# EAGLE design irisc (EAGLE 9.2.2)
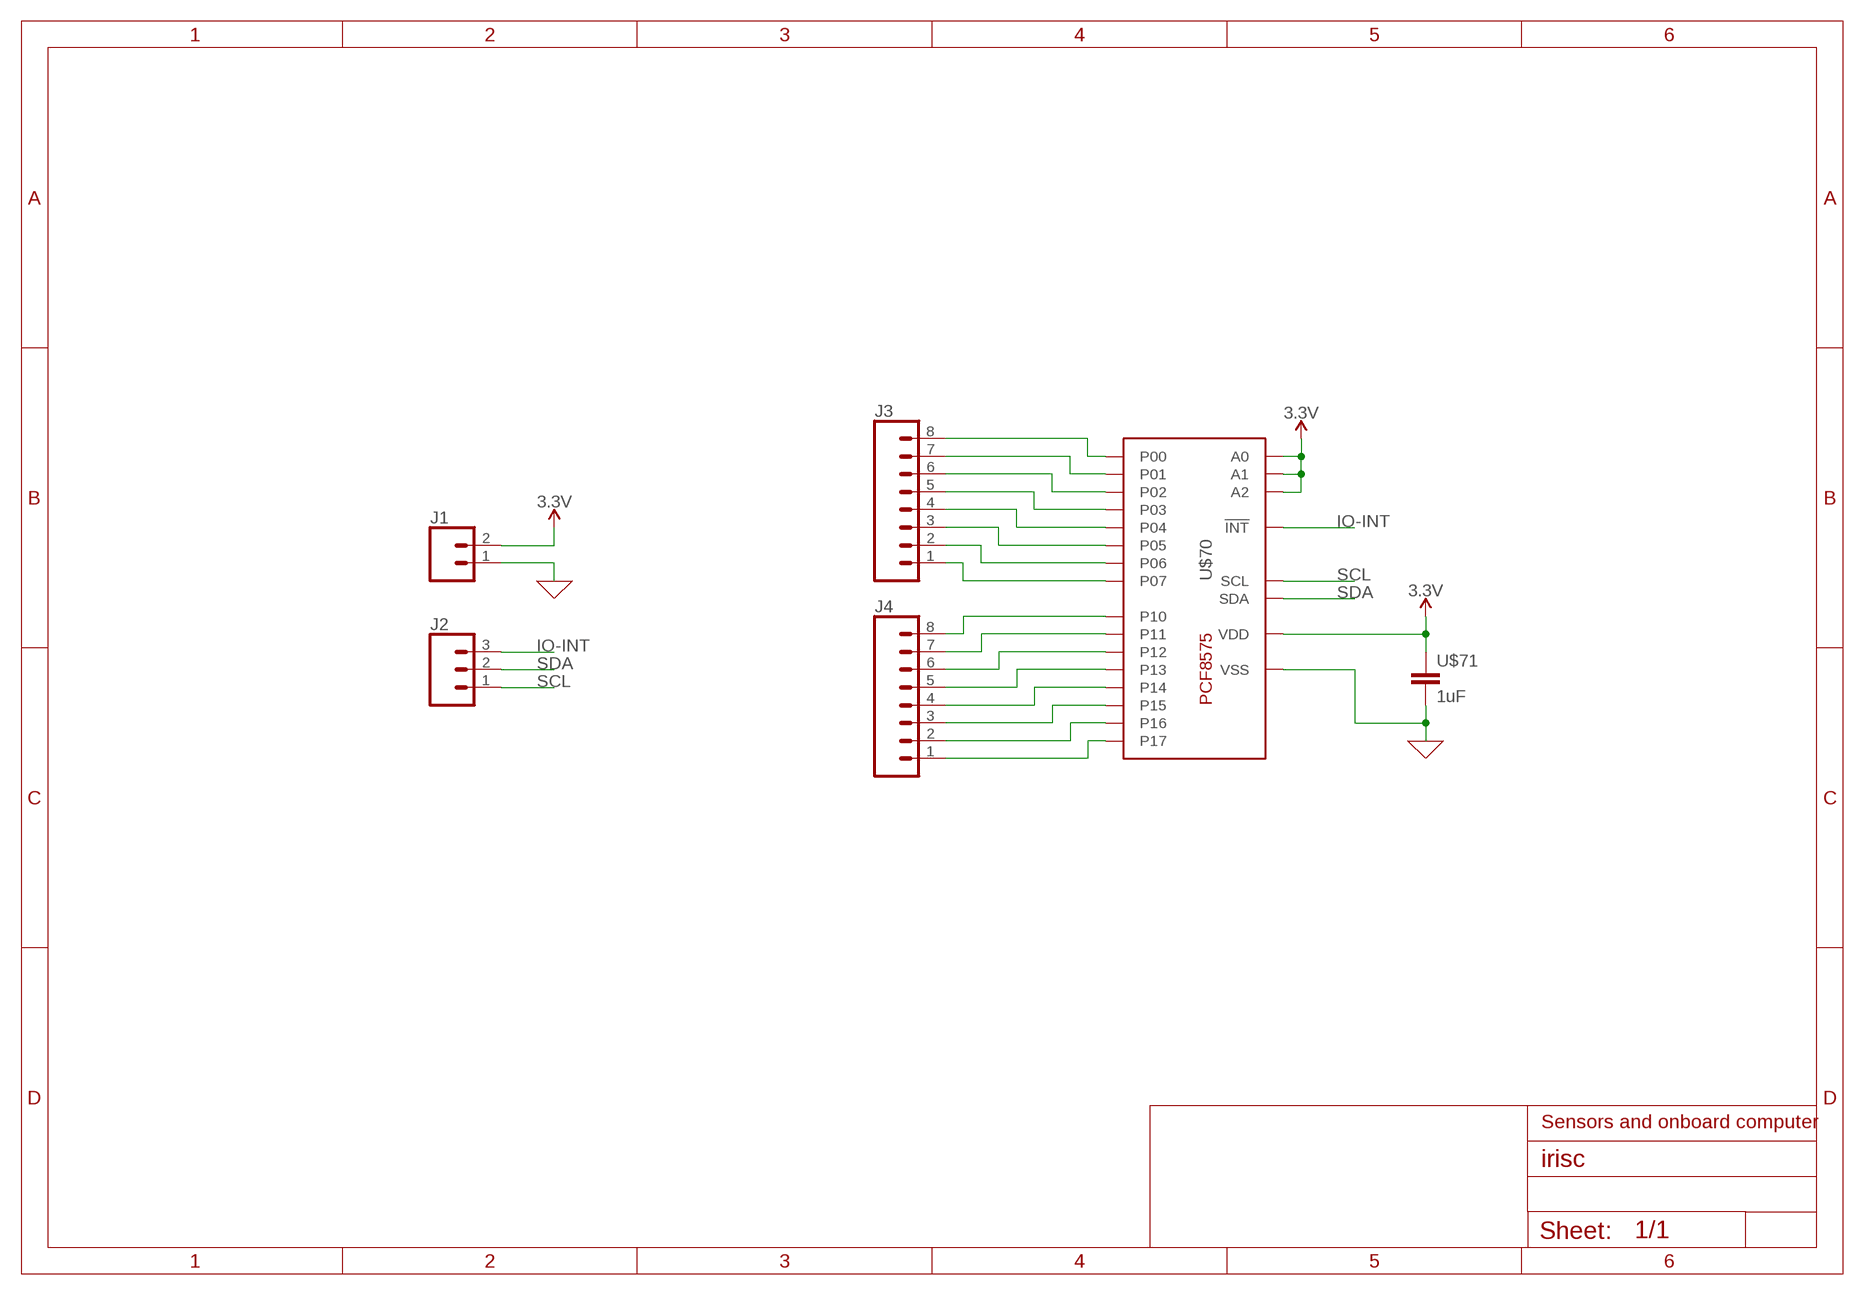
[diagram p0: schematic, sheet 1]

## Parts
J1  CONN_02  [1X02]
J2  CONN_03  [1X03]
J3  CONN_08"  [1X08]
J4  CONN_08"  [1X08]
U$70  PCF8575CSSOP24N  [SOP65P810X120-24]
U$71  1uF  CAPACITOR_0603_N  [RESC0603_N]

## Nets
0: J1.1 U$70.12(VSS) U$71.2 ; supply symbol labelled GND
3.3V: J1.2 U$70.2(A1) U$70.3(A2) U$70.21(A0) U$70.24(VDD) U$71.1
IO-INT: J2.3 U$70.1(!INT)
N$1: J3.8 U$70.4(P00)
N$2: J3.7 U$70.5(P01)
N$3: J3.6 U$70.6(P02)
N$4: J3.5 U$70.7(P03)
N$5: J3.4 U$70.8(P04)
N$6: J3.3 U$70.9(P05)
N$7: J3.2 U$70.10(P06)
N$8: J3.1 U$70.11(P07)
N$9: J4.8 U$70.13(P10)
N$10: J4.7 U$70.14(P11)
N$11: J4.6 U$70.15(P12)
N$12: J4.5 U$70.16(P13)
N$13: J4.4 U$70.17(P14)
N$14: J4.3 U$70.18(P15)
N$15: J4.2 U$70.19(P16)
N$16: J4.1 U$70.20(P17)
SCL: J2.1 U$70.22(SCL)
SDA: J2.2 U$70.23(SDA)

## Notes on the sheet
- Sensors and onboard computer

## Library data of the parts
J1 = SparkFun-Connectors:CONN_02: Multi connection point. Often used as Generic Header-pin footprint for 0.1 inch spaced/style header connections On any of the 0.1 inch spaced packages, you can populate with these: Break Away Headers - Straight <https://www.sparkfun.com/products/116> (PRT-00116) Break Away Male Headers - Right Angle <https://www.sparkfun.com/products/553> (PRT-00553) Female Headers <https://www.sparkfun.com/products/115> (PRT-00115) Break Away Headers - Machine Pin <https://www.sparkfun.com/products/117> (PRT-00117) Break Away Female Headers - Swiss Machine Pin <https://www.sparkfun.com/products/743> (PRT-00743) For SCREWTERMINALS and SPRING TERMINALS visit here: Screw Terimnals on SparkFun.com <https://www.sparkfun.com/search/results?term=Screw+Terminals> (5mm/3.5mm/2.54mm spacing) This device is also useful as a general connection point to wire up your design to another part of your project. Our various solder wires solder well into these plated through hole pads. Hook-Up Wire - Assortment (Stranded, 22 AWG) <https://www.sparkfun.com/products/11375> (PRT-11375) Hook-Up Wire - Assortment (Solid Core, 22 AWG) <https://www.sparkfun.com/products/11367> (PRT-11367) View the entire wire category on our website here <https://www.sparkfun.com/categories/141> Special notes: Molex polarized connector foot print use with: PRT-08233 with associated crimp pins and housings. 2.54_SCREWTERM for use with PRT-10571. 3.5mm Screw Terminal footprints for PRT-08084 5mm Screw Terminal footprints for use with PRT-08432
J2 = SparkFun-Connectors:CONN_03: Multi connection point. Often used as Generic Header-pin footprint for 0.1 inch spaced/style header connections On any of the 0.1 inch spaced packages, you can populate with these: Break Away Headers - Straight <https://www.sparkfun.com/products/116> (PRT-00116) Break Away Male Headers - Right Angle <https://www.sparkfun.com/products/553> (PRT-00553) Female Headers <https://www.sparkfun.com/products/115> (PRT-00115) Break Away Headers - Machine Pin <https://www.sparkfun.com/products/117> (PRT-00117) Break Away Female Headers - Swiss Machine Pin <https://www.sparkfun.com/products/743> (PRT-00743) Stackable Header - 3 Pin (Female, 0.1") <https://www.sparkfun.com/products/13875> (PRT-13875) For SCREWTERMINALS and SPRING TERMINALS visit here: Screw Terimnals on SparkFun.com <https://www.sparkfun.com/search/results?term=Screw+Terminals> (5mm/3.5mm/2.54mm spacing) This device is also useful as a general connection point to wire up your design to another part of your project. Our various solder wires solder well into these plated through hole pads. Hook-Up Wire - Assortment (Stranded, 22 AWG) <https://www.sparkfun.com/products/11375> (PRT-11375) Hook-Up Wire - Assortment (Solid Core, 22 AWG) <https://www.sparkfun.com/products/11367> (PRT-11367) View the entire wire category on our website here <https://www.sparkfun.com/categories/141> Special notes: Molex polarized connector foot print use with SKU : PRT-08232 with associated crimp pins and housings.
J3 J4 = SparkFun-Connectors:CONN_08: Multi connection point. Often used as Generic Header-pin footprint for 0.1 inch spaced/style header connections On any of the 0.1 inch spaced packages, you can populate with these: Break Away Headers - Straight <https://www.sparkfun.com/products/116> (PRT-00116) Break Away Male Headers - Right Angle <https://www.sparkfun.com/products/553> (PRT-00553) Female Headers <https://www.sparkfun.com/products/115> (PRT-00115) Break Away Headers - Machine Pin <https://www.sparkfun.com/products/117> (PRT-00117) Break Away Female Headers - Swiss Machine Pin <https://www.sparkfun.com/products/743> (PRT-00743) Arduino Stackable Header - 8 Pin <https://www.sparkfun.com/products/9279> (PRT-09279) For SCREWTERMINALS and SPRING TERMINALS visit here: Screw Terimnals on SparkFun.com <https://www.sparkfun.com/search/results?term=Screw+Terminals> (5mm/3.5mm/2.54mm spacing) This device is also useful as a general connection point to wire up your design to another part of your project. Our various solder wires solder well into these plated through hole pads. Hook-Up Wire - Assortment (Stranded, 22 AWG) <https://www.sparkfun.com/products/11375> (PRT-11375) Hook-Up Wire - Assortment (Solid Core, 22 AWG) <https://www.sparkfun.com/products/11367> (PRT-11367) View the entire wire category on our website here <https://www.sparkfun.com/categories/141> Special notes: Molex polarized connector foot print use with SKU : PRT-08231 with associated crimp pins and housings. 1MM SMD Version SKU: PRT-10208 NOTES ON THE VARIANTS LOCK and LOCK_LONGPADS... This footprint was designed to help hold the alignment of a through-hole component (i.e. 6-pin header) while soldering it into place. You may notice that each hole has been shifted either up or down by 0.005 of an inch from it's more standard position (which is a perfectly straight line). This slight alteration caused the pins (the squares in the middle) to touch the edges of the holes. Because they are alternating, it causes a "brace" to hold the component in place. 0.005 has proven to be the perfect amount of "off-center" position when using our standard breakaway headers. Although looks a little odd when you look at the bare footprint, once you have a header in there, the alteration is very hard to notice. Also,if you push a header all the way into place, it is covered up entirely on the bottom side.; PROD_ID: CONN-08438
U$70 = pcf8575c:PCF8575C
U$71 = Nordic_nRF:CAPACITOR: Generic chip capacitor

## Board
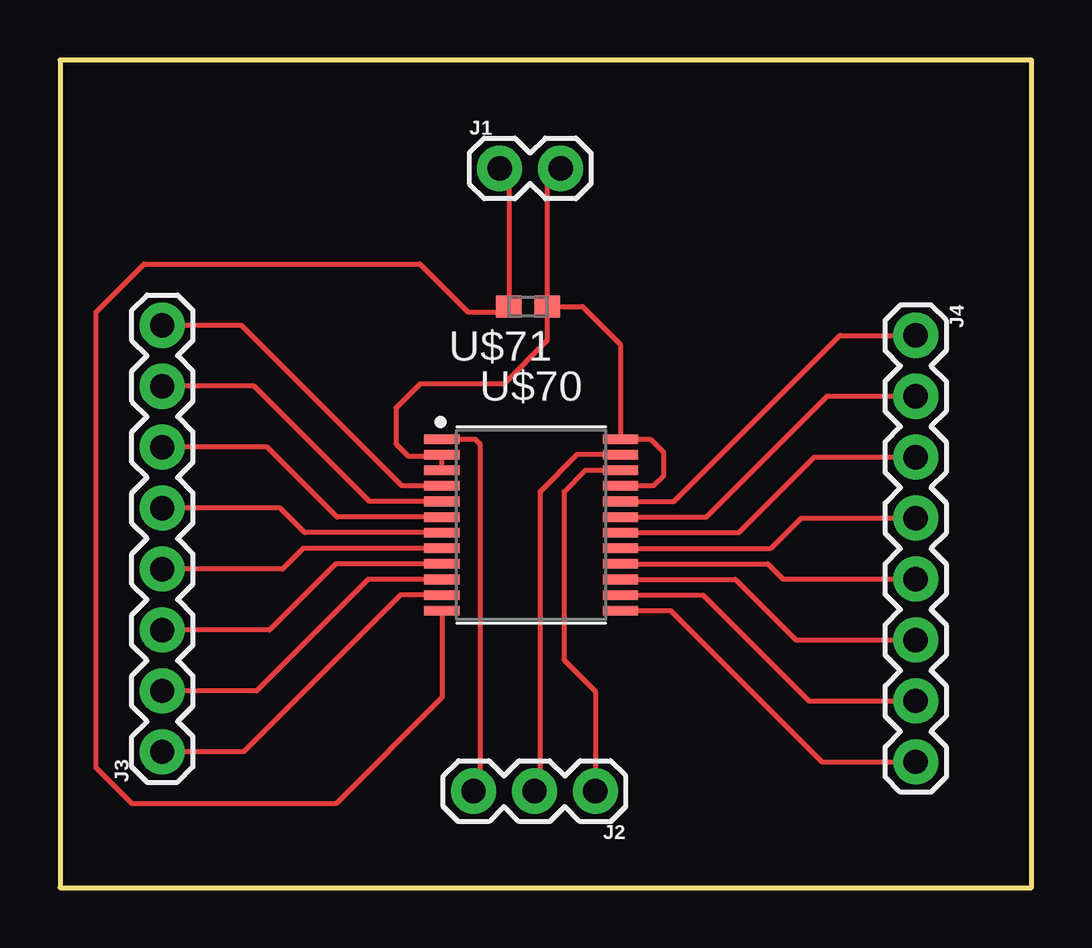
[diagram p1: board, top side]

Size 40.5 x 34.5 mm. Coordinates in mm from the lower left corner, seen from the top.
Outline: 0,0 40.5,0 40.5,34.5 0,34.5 0,0
Copper layers (1*16): Top 0.035mm / dielectric 1.5mm / Bottom 0.035mm
Design rules "default": minimum track width 6mil, minimum drill 0.35mm, track to track 6mil, track to pad 6mil, pad to pad 6mil, via to via 6mil, smd to smd 6mil, copper to edge 40mil, drill to drill 6mil, minimum pad ring 10mil, minimum via ring 8mil, stop-mask expansion 4mil, vias tented up to drill 0mil, thermal gap 10mil

### Footprints (pad centres in the part's own frame; a part is rotated, then mirrored left to right if it is on the bottom)
1X02 = drill 1.016 pad 1.88: 1 0,0; 2 2.54,0
1X03 = drill 1.016 pad 1.88: 1 0,0; 2 2.54,0; 3 5.08,0
1X08 = drill 1.016 pad 1.88: 1 0,0; 2 2.54,0; 3 5.08,0; 4 7.62,0; 5 10.16,0; 6 12.7,0; 7 15.24,0; 8 17.78,0
SOP65P810X120-24 = smd 1.469 x 0.402: 1 -3.721,3.575; 2 -3.721,2.925; 3 -3.721,2.275; 4 -3.721,1.625; 5 -3.721,0.975; 6 -3.721,0.325; 7 -3.721,-0.325; 8 -3.721,-0.975; 9 -3.721,-1.625; 10 -3.721,-2.275; 11 -3.721,-2.925; 12 -3.721,-3.575; 13 3.721,-3.575; 14 3.721,-2.925; 15 3.721,-2.275; 16 3.721,-1.625; 17 3.721,-0.975; 18 3.721,-0.325; 19 3.721,0.325; 20 3.721,0.975; 21 3.721,1.625; 22 3.721,2.275; 23 3.721,2.925; 24 3.721,3.575
RESC0603_N = smd 1.05 x 0.9: 1 -0.8,0; 2 0.8,0

### Placement (x,y rotation side)
J1  18.33,29.98 0 top
J2  22.32,4.02 180 top
J3  4.26,5.66 90 top
J4  35.67,23.02 270 top
U$70  19.64,15.12 0 top
U$71  19.51,24.22 180 top

### Tracks (layer width: path | path; a pad name or v marks a point on that pad's centre or on a via)
0
  Top 0.2: J1.1 18.71,29.6 U$71.2 18.49,24 17,24 15,26 3.5,26 1.5,24 1.5,5 3,3.5 11.5,3.5 15.92,7.92 U$70.12
3.3V
  Top 0.2: J1.2 20.31,29.42 U$71.1 | U$71.1 21.78,24.22 23.36,22.64 U$70.24 24.61,18.7 25.15,18.16 25.15,17.14 24.75,16.75 U$70.21 | U$70.3 15.92,18 | 15.92,18 U$70.2 | U$71.1 20.31,22.81 18.5,21 15,21 14,20 14,18.5 14.5,18 15.92,18
IO-INT
  Top 0.2: U$70.1 17.3,18.7 17.5,18.5 17.5,4.28 J2.3
N$1
  Top 0.2: U$70.4 14.26,16.75 7.56,23.44 J3.8
N$2
  Top 0.2: U$70.5 12.9,16.09 8.1,20.9 J3.7
N$3
  Top 0.2: U$70.6 11.55,15.45 8.64,18.36 J3.6
N$4
  Top 0.2: U$70.7 10.21,14.79 9.18,15.82 J3.5
N$5
  Top 0.2: U$70.8 10.14,14.14 9.28,13.28 J3.4
N$6
  Top 0.2: U$70.9 11.49,13.49 8.74,10.74 J3.3
N$7
  Top 0.2: U$70.10 12.85,12.85 8.2,8.2 J3.2
N$8
  Top 0.2: U$70.11 14.2,12.2 7.66,5.66 J3.1
N$9
  Top 0.2: U$70.13 25.45,11.54 31.76,5.24 J4.8
N$10
  Top 0.2: U$70.14 26.8,12.2 31.22,7.78 J4.7
N$11
  Top 0.2: U$70.15 28.16,12.85 30.68,10.32 J4.6
N$12
  Top 0.2: U$70.16 29.5,13.49 30.14,12.86 J4.5
N$13
  Top 0.2: U$70.17 29.64,14.14 30.9,15.4 J4.4
N$14
  Top 0.2: U$70.18 28.3,14.79 31.44,17.94 J4.3
N$15
  Top 0.2: U$70.19 26.95,15.45 31.98,20.48 J4.2
N$16
  Top 0.2: U$70.20 25.59,16.09 32.52,23.02 J4.1
SCL
  Top 0.2: U$70.22 21.89,17.39 21,16.5 21,9.5 22.32,8.18 J2.1
SDA
  Top 0.2: U$70.23 21.55,18.05 20,16.5 20,4.24 J2.2